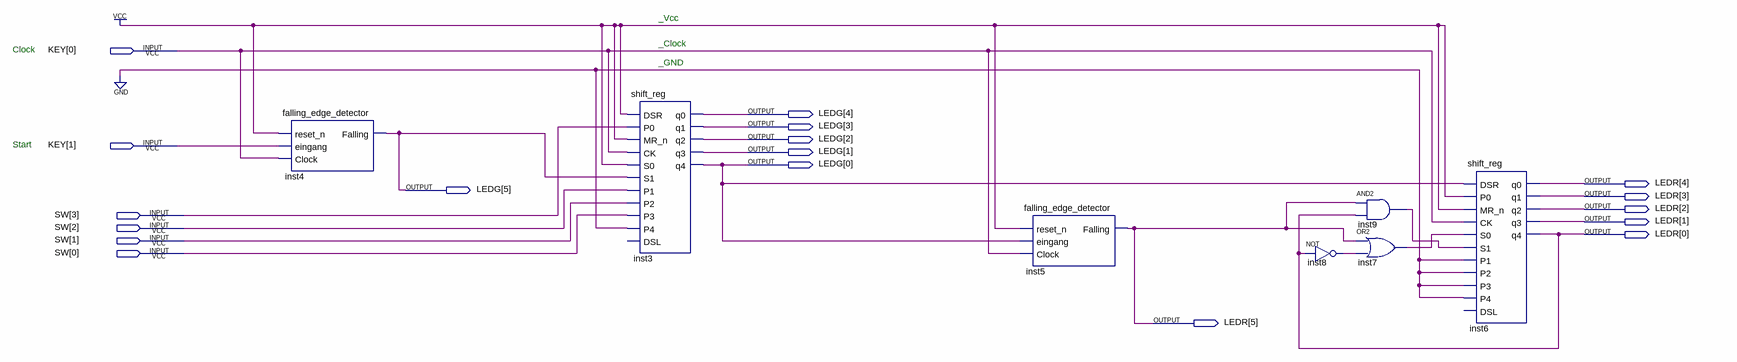
[diagram p0: schematic sheet]
// Quartus schematic 09_Lab.1.bdf as structural Verilog: 7 symbols, 18 pins
module \09_Lab.1  (
  input  [1:0] KEY,
  input  [3:0] SW,
  output [5:0] LEDG,
  output [5:0] LEDR
);

  wire inst7_out, inst8_out, inst9_out;

  falling_edge_detector inst4 (.reset_n(1'b1), .eingang(KEY[1]), .Clock(KEY[0]), .Falling(LEDG[5]));
  shift_reg inst3 (
    .DSR(1'b1), .P0(SW[3]), .MR_n(1'b1), .CK(KEY[0]), .S0(1'b1), .S1(LEDG[5]), .P1(SW[2]), .P2(SW[1]),
    .P3(SW[0]), .P4(1'b0), .q0(LEDG[4]), .q1(LEDG[3]), .q2(LEDG[2]), .q3(LEDG[1]), .q4(LEDG[0]));  // open: DSL
  falling_edge_detector inst5 (.reset_n(1'b1), .eingang(LEDG[0]), .Clock(KEY[0]), .Falling(LEDR[5]));
  not inst8 (inst8_out, LEDR[0]);
  and inst9 (inst9_out, LEDR[5], LEDR[0]);
  or inst7 (inst7_out, LEDR[5], inst8_out);
  shift_reg inst6 (
    .DSR(LEDG[0]), .P0(1'b1), .MR_n(1'b1), .CK(KEY[0]), .S0(inst7_out), .S1(inst9_out), .P1(1'b0), .P2(1'b0),
    .P3(1'b0), .P4(1'b0), .q0(LEDR[4]), .q1(LEDR[3]), .q2(LEDR[2]), .q3(LEDR[1]), .q4(LEDR[0]));  // open: DSL

  // Notes on the sheet:
  //   _Vcc
  //   _Clock
  //   Clock
  //   _GND
  //   Start
endmodule
